# EAGLE schematic isg-quantum-photonics-mainboard-rev1 (EAGLE 9.3.2)
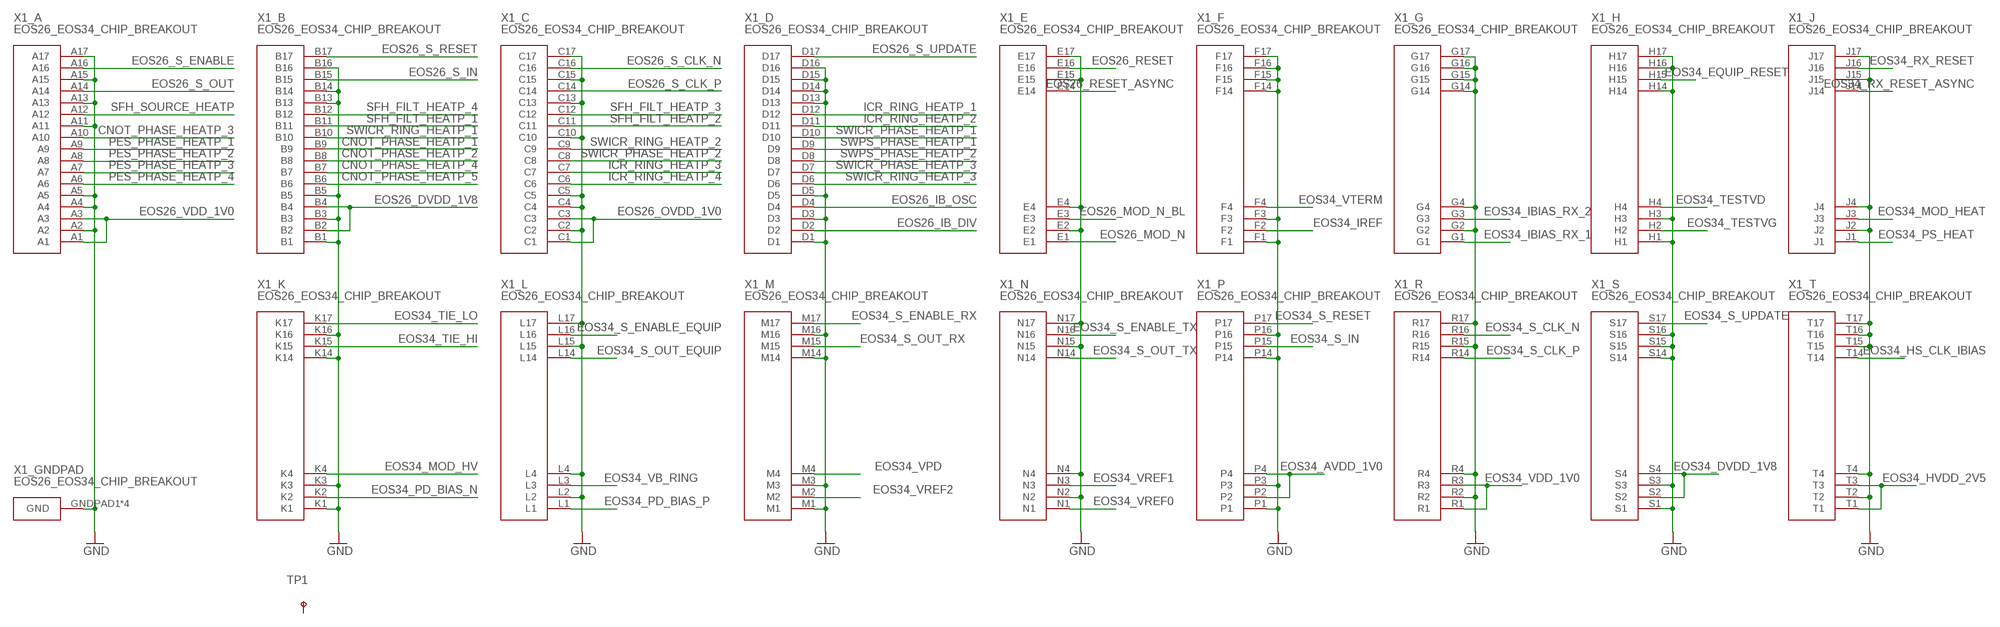
[diagram p0: schematic, sheet 1]

## Parts
TP1  KEYSTONE_5000  [KEYSTONE_5000_MINIATURE]
X1  EOS26_EOS34_CHIP_BREAKOUT  [EOS26_EOS34_CHIP_BREAKOUT]

## Nets
CNOT_PHASE_HEATP_1: X1.B9(_B:B9)
CNOT_PHASE_HEATP_2: X1.B8(_B:B8)
CNOT_PHASE_HEATP_3: X1.A10(_A:A10)
CNOT_PHASE_HEATP_4: X1.B7(_B:B7)
CNOT_PHASE_HEATP_5: X1.B6(_B:B6)
EOS26_DVDD_1V8: X1.B2(_B:B2) X1.B4(_B:B4)
EOS26_IB_DIV: X1.D2(_D:D2)
EOS26_IB_OSC: X1.D4(_D:D4)
EOS26_MOD_N: X1.E1(_E:E1)
EOS26_MOD_N_BL: X1.E3(_E:E3)
EOS26_OVDD_1V0: X1.C1(_C:C1) X1.C3(_C:C3)
EOS26_RESET: X1.E16(_E:E16)
EOS26_RESET_ASYNC: X1.E14(_E:E14)
EOS26_S_CLK_N: X1.C16(_C:C16)
EOS26_S_CLK_P: X1.C14(_C:C14)
EOS26_S_ENABLE: X1.A16(_A:A16)
EOS26_S_IN: X1.B15(_B:B15)
EOS26_S_OUT: X1.A14(_A:A14)
EOS26_S_RESET: X1.B17(_B:B17)
EOS26_S_UPDATE: X1.D17(_D:D17)
EOS26_VDD_1V0: X1.A1(_A:A1) X1.A3(_A:A3)
EOS34_AVDD_1V0: X1.P2(_P:P2) X1.P4(_P:P4)
EOS34_DVDD_1V8: X1.S2(_S:S2) X1.S4(_S:S4)
EOS34_EQUIP_RESET: X1.H15(_H:H15)
EOS34_HS_CLK_IBIAS: X1.T14(_T:T14)
EOS34_HVDD_2V5: X1.T1(_T:T1) X1.T3(_T:T3)
EOS34_IBIAS_RX_1: X1.G1(_G:G1)
EOS34_IBIAS_RX_2: X1.G3(_G:G3)
EOS34_IREF: X1.F2(_F:F2)
EOS34_MOD_HEAT: X1.J3(_J:J3)
EOS34_MOD_HV: X1.K4(_K:K4)
EOS34_PD_BIAS_N: X1.K2(_K:K2)
EOS34_PD_BIAS_P: X1.L1(_L:L1)
EOS34_PS_HEAT: X1.J1(_J:J1)
EOS34_RX_RESET: X1.J16(_J:J16)
EOS34_RX_RESET_ASYNC: X1.J14(_J:J14)
EOS34_S_CLK_N: X1.R16(_R:R16)
EOS34_S_CLK_P: X1.R14(_R:R14)
EOS34_S_ENABLE_EQUIP: X1.L16(_L:L16)
EOS34_S_ENABLE_RX: X1.M17(_M:M17)
EOS34_S_ENABLE_TX: X1.N16(_N:N16)
EOS34_S_IN: X1.P15(_P:P15)
EOS34_S_OUT_EQUIP: X1.L14(_L:L14)
EOS34_S_OUT_RX: X1.M15(_M:M15)
EOS34_S_OUT_TX: X1.N14(_N:N14)
EOS34_S_RESET: X1.P17(_P:P17)
EOS34_S_UPDATE: X1.S17(_S:S17)
EOS34_TESTVD: X1.H4(_H:H4)
EOS34_TESTVG: X1.H2(_H:H2)
EOS34_TIE_HI: X1.K15(_K:K15)
EOS34_TIE_LO: X1.K17(_K:K17)
EOS34_VB_RING: X1.L3(_L:L3)
EOS34_VDD_1V0: X1.R1(_R:R1) X1.R3(_R:R3)
EOS34_VPD: X1.M4(_M:M4)
EOS34_VREF0: X1.N1(_N:N1)
EOS34_VREF1: X1.N3(_N:N3)
EOS34_VREF2: X1.M2(_M:M2)
EOS34_VTERM: X1.F4(_F:F4)
GND: X1.A2(_A:A2) X1.A4(_A:A4) X1.A5(_A:A5) X1.A11(_A:A11) X1.A13(_A:A13) X1.A15(_A:A15) X1.A17(_A:A17) X1.B1(_B:B1) X1.B3(_B:B3) X1.B5(_B:B5) X1.B13(_B:B13) X1.B14(_B:B14) X1.B16(_B:B16) X1.C2(_C:C2) X1.C4(_C:C4) X1.C5(_C:C5) X1.C10(_C:C10) X1.C13(_C:C13) X1.C15(_C:C15) X1.C17(_C:C17) X1.D1(_D:D1) X1.D3(_D:D3) X1.D5(_D:D5) X1.D13(_D:D13) X1.D14(_D:D14) X1.D15(_D:D15) X1.D16(_D:D16) X1.E2(_E:E2) X1.E4(_E:E4) X1.E15(_E:E15) X1.E17(_E:E17) X1.F1(_F:F1) X1.F3(_F:F3) X1.F14(_F:F14) X1.F15(_F:F15) X1.F16(_F:F16) X1.F17(_F:F17) X1.G2(_G:G2) X1.G4(_G:G4) X1.G14(_G:G14) X1.G15(_G:G15) X1.G16(_G:G16) X1.G17(_G:G17) X1.GNDPAD1(_GNDPAD:GND) X1.GNDPAD2(_GNDPAD:GND) X1.GNDPAD3(_GNDPAD:GND) X1.GNDPAD4(_GNDPAD:GND) X1.H1(_H:H1) X1.H3(_H:H3) X1.H14(_H:H14) X1.H16(_H:H16) X1.H17(_H:H17) X1.J2(_J:J2) X1.J4(_J:J4) X1.J15(_J:J15) X1.J17(_J:J17) X1.K1(_K:K1) X1.K3(_K:K3) X1.K14(_K:K14) X1.K16(_K:K16) X1.L2(_L:L2) X1.L4(_L:L4) X1.L15(_L:L15) X1.L17(_L:L17) X1.M1(_M:M1) X1.M3(_M:M3) X1.M14(_M:M14) X1.M16(_M:M16) X1.N2(_N:N2) X1.N4(_N:N4) X1.N15(_N:N15) X1.N17(_N:N17) X1.P1(_P:P1) X1.P3(_P:P3) X1.P14(_P:P14) X1.P16(_P:P16) X1.R2(_R:R2) X1.R4(_R:R4) X1.R15(_R:R15) X1.R17(_R:R17) X1.S1(_S:S1) X1.S3(_S:S3) X1.S14(_S:S14) X1.S15(_S:S15) X1.S16(_S:S16) X1.T2(_T:T2) X1.T4(_T:T4) X1.T15(_T:T15) X1.T16(_T:T16) X1.T17(_T:T17)
ICR_RING_HEATP_1: X1.D12(_D:D12)
ICR_RING_HEATP_2: X1.D11(_D:D11)
ICR_RING_HEATP_3: X1.C7(_C:C7)
ICR_RING_HEATP_4: X1.C6(_C:C6)
PES_PHASE_HEATP_1: X1.A9(_A:A9)
PES_PHASE_HEATP_2: X1.A8(_A:A8)
PES_PHASE_HEATP_3: X1.A7(_A:A7)
PES_PHASE_HEATP_4: X1.A6(_A:A6)
SFH_FILT_HEATP_1: X1.B11(_B:B11)
SFH_FILT_HEATP_2: X1.C11(_C:C11)
SFH_FILT_HEATP_3: X1.C12(_C:C12)
SFH_FILT_HEATP_4: X1.B12(_B:B12)
SFH_SOURCE_HEATP: X1.A12(_A:A12)
SWICR_PHASE_HEATP_1: X1.D10(_D:D10)
SWICR_PHASE_HEATP_2: X1.C8(_C:C8)
SWICR_PHASE_HEATP_3: X1.D7(_D:D7)
SWICR_RING_HEATP_1: X1.B10(_B:B10)
SWICR_RING_HEATP_2: X1.C9(_C:C9)
SWICR_RING_HEATP_3: X1.D6(_D:D6)
SWPS_PHASE_HEATP_1: X1.D9(_D:D9)
SWPS_PHASE_HEATP_2: X1.D8(_D:D8)
Unconnected: TP1.P$1

## Library data of the parts
TP1 = Kramnik's Library:KEYSTONE_5000
X1 = isg-quantum-photonics-mainboard-rev1:EOS26_EOS34_CHIP_BREAKOUT